# Altium project mod_ADV7280-M.PrjPcb
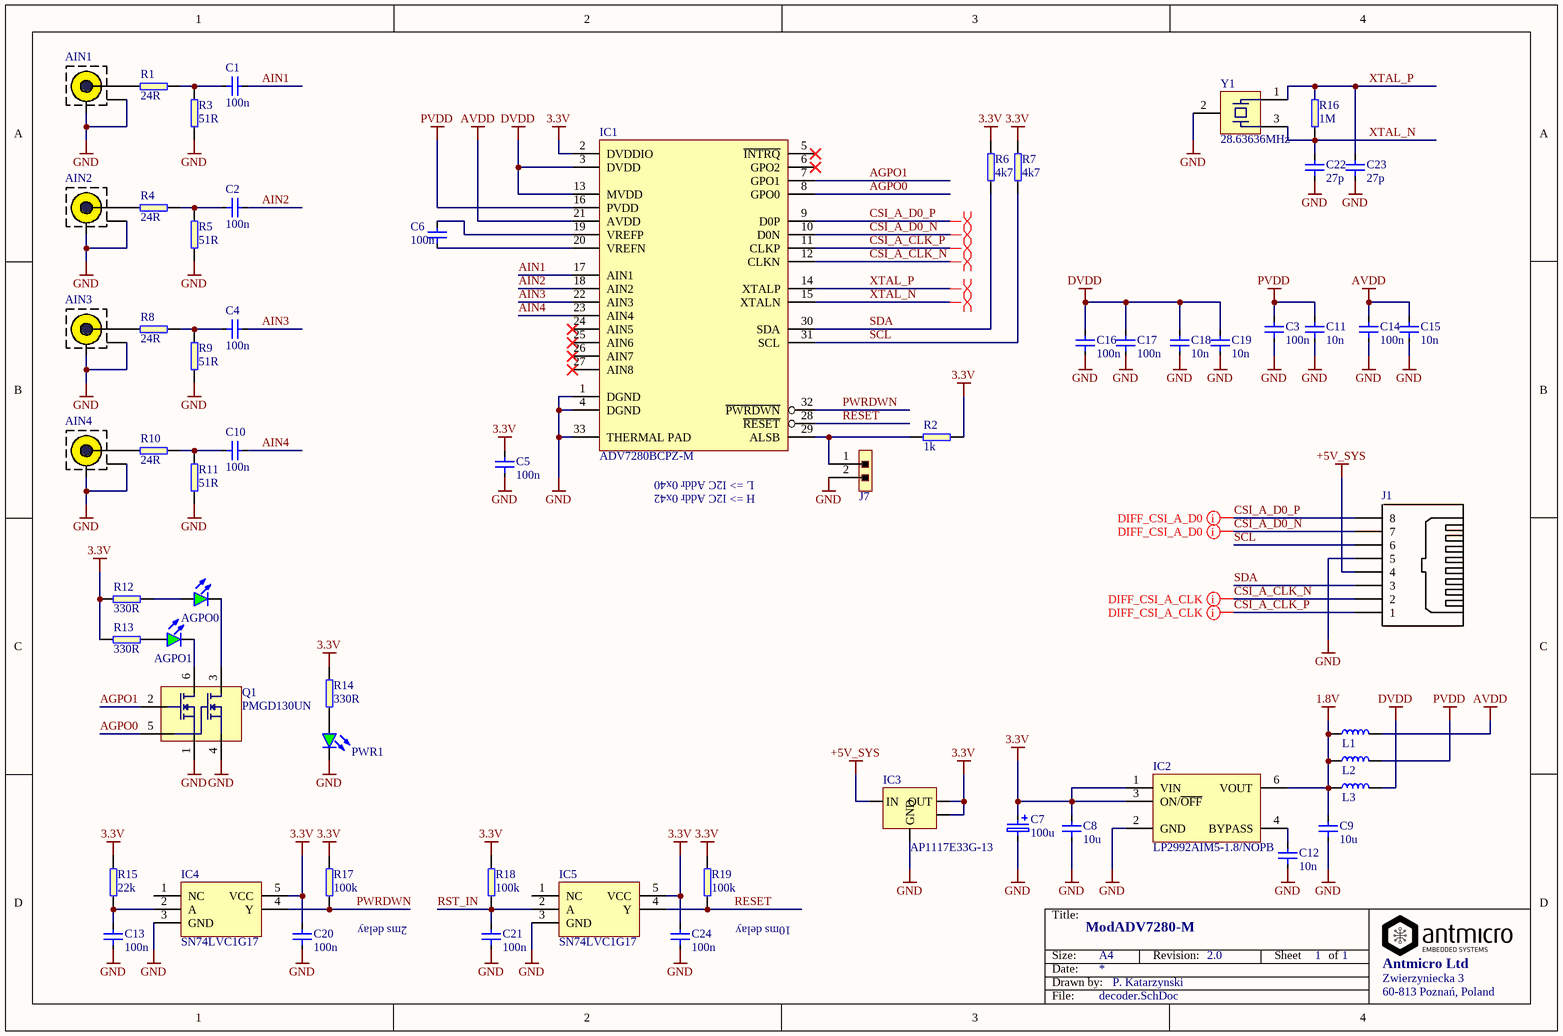
[diagram p0: decoder.SchDoc]
1 sheet, 62 parts. Net scope: global (net labels, ports and power ports of the same name join across sheets).
Board files: decoder.PcbDoc, Panel.PcbDoc

## Sheet decoder.SchDoc: ModADV7280-M
size A4; Author: P. Katarzynski; CompanyName: Antmicro Ltd; Address1: Zwierzyniecka 3; Address2: 60-813 Poznań; Address3: Poland; Address4: 60-813 Poznań, Poland; Revision: 2.0; SheetNumber: 1; SheetTotal: 1; PageSetup: Record=PageOptions|CenterHorizontal=True|CenterVertical=True|PrintScale=0.97|XCorrection=1.00|YCorrection=1.00|PrintKind=1|BorderSize=5000000|LeftOffset=0|BottomOffset=0|Orientation=2|PaperLength=2970|PaperWidth=2100|Scale=100|PaperSource=7|PrintQuality=600|MediaType=1|DitherType=10|PaperKind=A4|PrintScaleMode=1

### Parts
AGPO0  *  [LED0603]  (value not drawn)
AGPO1  *  [LED0603]  (value not drawn)
AIN1  (no value)  [CC-134B]
AIN2  (no value)  [CC-134B]
AIN3  (no value)  [CC-134B]
AIN4  (no value)  [CC-134B]
C1  100n  [0603]
C2  100n  [0603]
C3  100n  [0603]
C4  100n  [0603]
C5  100n  [0603]
C6  100n  [0603]
C7  value 100u  [KEMET_A]
C8  10u  [0603]
C9  10u  [0603]
C10  100n  [0603]
C11  10n  [0603]
C12  10n  [0603]
C13  100n  [0603]
C14  100n  [0603]
C15  10n  [0603]
C16  100n  [0603]
C17  100n  [0603]
C18  10n  [0603]
C19  10n  [0603]
C20  100n  [0603]
C21  100n  [0603]
C22  27p  [0603]
C23  27p  [0603]
C24  100n  [0603]
IC1  ADV7280BCPZ-M  [LFCSP-32]
IC2  LP2992AIM5-1.8/NOPB  [SOT23-5N]
IC3  value AP1117E33G-13  [SOT223]  (hidden comment: *)
IC4  SN74LVC1G17  [SOT23127P600-8N]
IC5  SN74LVC1G17  [SOT23127P600-8N]
J1  (no value)  [RJ45 AMP-1-406541]
J7  *  [HEADER_1X2_male 2.54mm]  (value not drawn)
L1  *  [0805]  (value not drawn)
L2  *  [0805]  (value not drawn)
L3  *  [0805]  (value not drawn)
PWR1  *  [LED0603]  (value not drawn)
Q1  PMGD130UN  [TSOP65P210X110-6N]
R1  24R  [0603]
R2  1k  [0603]
R3  51R  [0805]
R4  24R  [0603]
R5  51R  [0805]
R6  4k7  [0603]
R7  4k7  [0603]
R8  24R  [0603]
R9  51R  [0805]
R10  24R  [0603]
R11  51R  [0805]
R12  330R  [0603]
R13  330R  [0603]
R14  330R  [0603]
R15  22k  [0603]
R16  1M  [0603]
R17  100k  [0603]
R18  100k  [0603]
R19  100k  [0603]
Y1  28.63636MHz  [TXC_7B]

### Nets
1.8V: C9.2 IC2.6(VOUT) L1.1 L2.1 L3.1
3.3V: C5.2 C7.1 C8.2 C20.2 C24.2 IC1.2(DVDDIO) IC2.1(VIN) IC2.3(ON/~{OFF}) IC3.2(OUT) IC3.4(OUT) IC4.5(VCC) IC5.5(VCC) R2.1 R6.2 R7.2 R12.2 R13.2 R14.2 R15.2 R17.2 R18.2 R19.2
+5V_SYS: IC3.3(IN) J1.4
AVDD: C14.2 C15.2 IC1.21(AVDD) L1.2
DVDD: C16.2 C17.2 C18.2 C19.2 IC1.3(DVDD) IC1.13(MVDD) L3.2
GND: AIN1.GND AIN1.SHIELD AIN2.GND AIN2.SHIELD AIN3.GND AIN3.SHIELD AIN4.GND AIN4.SHIELD C3.1 C5.1 C7.2 C8.1 C9.1 C11.1 C12.1 C13.1 C14.1 C15.1 C16.1 C17.1 C18.1 C19.1 C20.1 C21.1 C22.1 C23.1 C24.1 IC1.1(DGND) IC1.4(DGND) IC1.33(THERMAL_PAD) IC2.2(GND) IC3.1(GND) IC4.3(GND) IC5.3(GND) J1.5 J7.2 PWR1.K Q1.1(S1) Q1.4(S2) R3.1 R5.1 R9.1 R11.1 Y1.2(GND)
PVDD: C3.2 C11.2 IC1.16(PVDD) L2.2
AGPO0: IC1.8(GPO0) Q1.5(G2)
AGPO1: IC1.7(GPO1) Q1.2(G1)
AIN1: C1.2 IC1.17(AIN1)
AIN2: C2.2 IC1.18(AIN2)
AIN3: C4.2 IC1.22(AIN3)
AIN4: C10.2 IC1.23(AIN4)
CSI_A_CLK_N: IC1.12(CLKN) J1.2
CSI_A_CLK_P: IC1.11(CLKP) J1.1
CSI_A_D0_N: IC1.10(D0N) J1.7
CSI_A_D0_P: IC1.9(D0P) J1.8
PWRDWN: IC1.32(~{PWRDWN}) IC4.4(Y) R17.1
RESET: IC1.28(~{RESET}) IC5.4(Y) R19.1
RST_IN: C21.2 IC5.2(A) R18.1
SCL: IC1.31(SCL) J1.6 R7.1
SDA: IC1.30(SDA) J1.3 R6.1
XTAL_N: C22.2 IC1.15(XTALN) R16.1 Y1.3(XTAL2)
XTAL_P: C23.2 IC1.14(XTALP) R16.2 Y1.1(XTAL1)
NetAGPO0_A: AGPO0.A R12.1
NetAGPO0_K: AGPO0.K Q1.3(D2)
NetAGPO1_A: AGPO1.A R13.1
NetAGPO1_K: AGPO1.K Q1.6(D1)
NetAIN1_SIGNAL: AIN1.SIGNAL R1.1
NetAIN2_SIGNAL: AIN2.SIGNAL R4.1
NetAIN3_SIGNAL: AIN3.SIGNAL R8.1
NetAIN4_SIGNAL: AIN4.SIGNAL R10.1
NetC1_1: C1.1 R1.2 R3.2
NetC2_1: C2.1 R4.2 R5.2
NetC4_1: C4.1 R8.2 R9.2
NetC6_1: C6.1 IC1.20(VREFN)
NetC6_2: C6.2 IC1.19(VREFP)
NetC10_1: C10.1 R10.2 R11.2
NetC12_2: C12.2 IC2.4(BYPASS)
NetC13_2: C13.2 IC4.2(A) R15.1
NetIC1_29: IC1.29(ALSB) J7.1 R2.2
NetPWR1_A: PWR1.A R14.1

Not connected (* = marked no-connect by the designer): IC1 5(~{INTRQ})* 6(GPO2)* 24(AIN5)* 25(AIN6)* 26(AIN7)* 27(AIN8)*; IC4 1(NC); IC5 1(NC)

### Layout directives
differential pair: CSI_A_CLK_N, CSI_A_CLK_P, CSI_A_D0_N, CSI_A_D0_P, XTAL_N, XTAL_P

### Notes on the sheet
- (near IC1) L => I2C Addr 0x40
- H => I2C Addr 0x42
- 2ms delay
- 10ms delay
- Title:
- Size:
- Date:
- Drawn by:
- A4
- Revision:
- Sheet
- of
- File:

### Library data of the parts
AGPO0 AGPO1 PWR1 = LED_G: LED Green 0603 case; Part Number: LED_G; Value: KPT-1608SGC; Component Kind: Standard; Component Type: Standard; Library Reference: LED; Pin Count: 2; Supplier 1: Farnell; Supplier Part Number 1: 2099223
AIN1-AIN4 = CC-134B: Shielded RCA socket; Part Number: CC-134B; Supplier Part Number 1: CC-134B/GOLD; Supplier 1: TME
C1-C6 C10 C13 C14 C16 C17 C20 C21 C24 = C_100n_0603: MLCC SMT Capacitor 100nF 0603; Tolerance: 5%; Value: 100n; Part Number: C_100n_0603; Component type: standard; Pin count: 2; Supplier 1: Farnell; Supplier Part Number 1: 2332586
C7 = C_100u_KEMET_A: Tantalum SMT Capacitor 100uF Case KEMET_A; Part Number: C_100u_KEMET_A; Component type: standard; Pin count: 2; Supplier 1: Farnell; Supplier Part Number 1: 1961933
C8 C9 = C_10u_0603: MLCC SMT Capacitor 10uF 0603; Value: 10u; Part Number: C_10u_0603; Component type: standard; Pin count: 2; Supplier 1: Farnell; Supplier Part Number 1: 1759393
C11 C12 C15 C18 C19 = C_10n_0603: MLCC SMT Capacitor 10nF 0603; Value: 10n; Part Number: C_10n_0603; Component type: standard; Pin count: 2; Supplier 1: Farnell; Supplier Part Number 1: 1833876
C22 C23 = C_27p_0603: MLCC SMT Capacitor 27pF 0603; Value: 27p; Part Number: C_27p_0603; Component type: standard; Pin count: 2; Supplier 1: Farnell; Supplier Part Number 1: 1758870
IC1 = ADV7280BCPZ-M: MIPI 10Bit 4x Oversampled SDTV Video Decoder with Deinterlacer; Part Number: ADV7280BCPZ-M; Value: ADV7280BCPZ-M; Supplier 1: Mouser; Supplier Part Number 1: ADV7280BCPZ-M
IC2 = LP2992AIM5-1.8: LDO 1.8V 250mA; Part Number: LP2992AIM5-1.8; Supplier 1: Farnell; Supplier Part Number 1: 2436470; Value: LP2992AIM5-1.8/NOPB
IC3 = AP1117E33G-13: IC, LDO, REG, 3.3V, SOT223; Part Number: AP1117E33G-13; Supplier 1: Farnell; Supplier Part Number 1: 1825291
IC4 IC5 = SN74LVC1G17: Single Schmitt trigger buffer; Part Number: SN74LVC1G17; Value: SN74LVC1G17; Supplier 1: Farnell; Supplier Part Number 1: 1236333; Supplier 2: Mouser; Supplier Part Number 2: 595-74LVC1G17MDCKREP
J1 = RJ45 AMP-1-406541: MODULAR, JACK, THT, R/A, RJ45, 8P8C; Part Number: RJ45 AMP-1-406541; Supplier Part Number 1: 1162481; Supplier 1: Farnell
J7 = HEADER_1X2_male: 1x2 pinhead male; Part Number: HEADER_1X2_male; Component Kind: Standard; Type: Standard; Pin Count: 2
L1-L3 = 742792022: WURTH ELEKTRONIK - 742792022 - FERRITE BEAD, 0.05OHM, 2A, 0805; Resistance: 0.05R; Tolerance: 25%; Part Number: 742792022; Component Kind: Standard; Component Type: Standard; Library Reference: FerriteBead; Pin Count: 2; Supplier 1: Farnell; Supplier Part Number 1: 1635733; Current: 2A
Q1 = PMGD130UN: 20 V, dual N-channel Trench MOSFET; Part Number: PMGD130UN; Value: PMGD130UN; Supplier 1: Farnell; Supplier Part Number 1: 2311192
R1 R4 R8 R10 = R_24R_0603: SMT Resistor 24R 0603; Value: 24R; Part Number: R_24R_0603; Component type: standard; Pin count: 2; Supplier 1: Farnell; Supplier Part Number 1: 1627705RL
R2 = R_1k_0603: SMT Resistor 1k 0603; Tolerance: 5%; Value: 1k; Part Number: R_1k_0603; Component type: standard; Pin count: 2; Supplier 1: Farnell; Supplier Part Number 1: 2333561
R3 R5 R9 R11 = R_51R_0805: SMT Resistor 51R 0805; Tolerance: 1%; Value: 51R; Part Number: R_51R_0805; Component type: standard; Pin count: 2; Supplier 1: Farnell; Supplier Part Number 1: 1865239
R6 R7 = R_4k7_0603: SMT Resistor 4k7 0603; Value: 4k7; Part Number: R_4k7_0603; Component type: standard; Pin count: 2; Supplier 1: Farnell; Supplier Part Number 1: 2008340
R12-R14 = R_330R_0603: SMT Resistor 330R 0603; Tolerance: 5%; Value: 330R; Part Number: R_330R_0603; Component type: standard; Pin count: 2; Supplier 1: Farnell; Supplier Part Number 1: 2008334
R15 = R_22k_0603: SMT Resistor 22k 0603; Value: 22k; Part Number: R_22k_0603; Component type: standard; Pin count: 2; Supplier 1: Farnell; Supplier Part Number 1: 2008363
R16 = R_1M_0603: SMT Resistor 1M 0603; Value: 1M; Part Number: R_1M_0603; Component type: standard; Pin count: 2; Supplier 1: Farnell; Supplier Part Number 1: 2008367
R17-R19 = R_100k_0603: SMT Resistor 100k 0603; Tolerance: 5%; Value: 100k; Part Number: R_100k_0603; Component type: standard; Pin count: 2; Supplier 1: Farnell; Supplier Part Number 1: 2008366
Y1 = 7B-28.63636MAAJ-T: TXC  7B-28.63636MAAJ-T  XTAL, 28.63636MHZ, 18PF, SMD, 5X3.2; Part Number: 7B-28.63636MAAJ-T; Component Kind: Standard; Component Type: Standard; Library Reference: TXC_7B; Pin Count: 4; Value: 28.63636MHz; Supplier 1: Farnell; Supplier Part Number 1: 1842003RL